# EAGLE schematic powersupply (EAGLE 9.2.2)
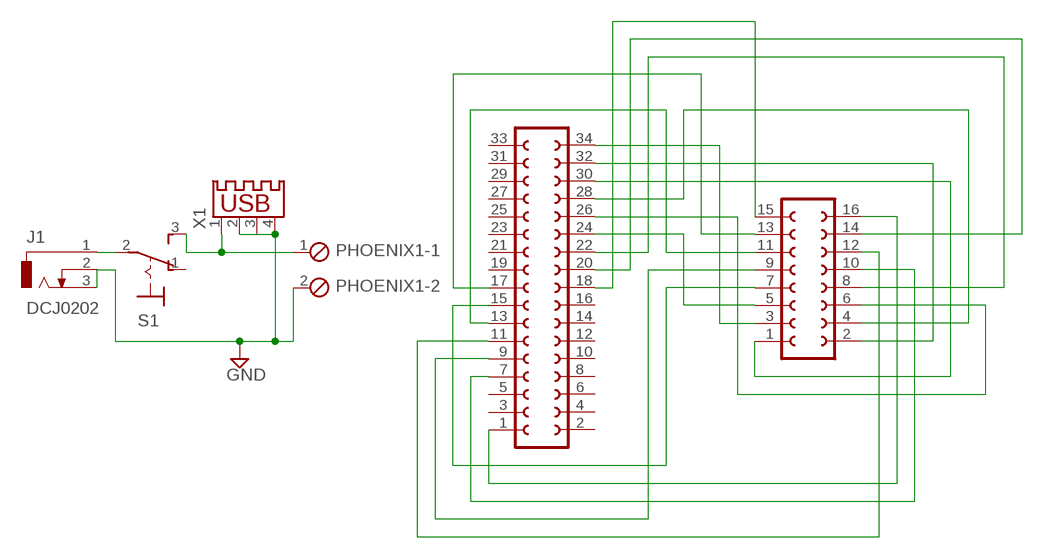
[diagram p0: schematic, sheet 1]

## Parts
J1  DCJ0202  [DCJ0202]
PHOENIX1  MPT2  [2POL254]
S1  M9040P  [M9040P]
SV1  FE17-2  [FE17-2]
SV2  FE08-2  [FE08-2]
X1  USB-A003  [USB-A003]

## Nets
GND: J1.2 J1.3 PHOENIX1.2 X1.2 X1.3 X1.4
N$1: J1.1 S1.2(P)
N$2: PHOENIX1.1 S1.3(S) X1.1
N$3: SV1.1 SV2.16
N$4: SV1.7 SV2.10
N$5: SV1.9 SV2.9
N$6: SV1.11 SV2.12
N$7: SV1.13 SV2.11
N$8: SV1.15 SV2.7
N$9: SV1.17 SV2.13
N$10: SV1.34 SV2.3
N$11: SV1.32 SV2.2
N$12: SV1.30 SV2.1
N$13: SV1.28 SV2.4
N$14: SV1.26 SV2.6
N$15: SV1.24 SV2.5
N$16: SV1.22 SV2.8
N$17: SV1.20 SV2.14
N$18: SV1.18 SV2.15
Unconnected: S1.1(O) SV1.2 SV1.3 SV1.4 SV1.5 SV1.6 SV1.8 SV1.10 SV1.12 SV1.14 SV1.16 SV1.19 SV1.21 SV1.23 SV1.25 SV1.27 SV1.29 SV1.31 SV1.33

## Library data of the parts
J1 = con-jack:DCJ0202: DC POWER JACK Source: DCJ0202.pdf; OC_FARNELL: unknown; OC_NEWARK: unknown
PHOENIX1 = con-phoenix-254:MPT2: PHOENIX CONNECTOR; OC_FARNELL: unknown; OC_NEWARK: unknown
S1 = switch:M9040P: TOGGLE SWITCH Marquardt
SV1 = con-lsta:FE17-2: FEMALE HEADER; OC_FARNELL: unknown; OC_NEWARK: unknown
SV2 = con-lsta:FE08-2: FEMALE HEADER; OC_FARNELL: unknown; OC_NEWARK: unknown
X1 = con-yamaichi:USB-A003: USB connector; OC_FARNELL: unknown; OC_NEWARK: unknown